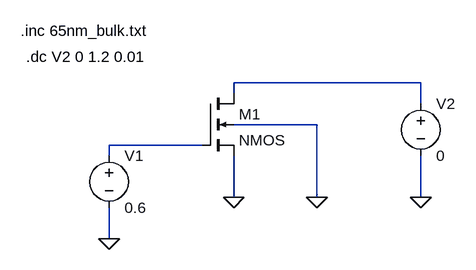
[diagram p0: schematic NMOS_Char.asc]
NMOS_Char.asc, the LTspice schematic file:
Version 4.1
SHEET 1 880 680
WIRE 464 80 176 80
WIRE 176 96 176 80
WIRE 464 112 464 80
WIRE 304 144 176 144
WIRE 128 176 -16 176
WIRE -16 192 -16 176
WIRE 176 256 176 192
WIRE 304 256 304 144
WIRE 464 256 464 192
WIRE -16 320 -16 272
FLAG -16 320 0
FLAG 176 256 0
FLAG 304 256 0
FLAG 464 256 0
SYMBOL nmos4 128 96 R0
SYMATTR InstName M1
SYMATTR Value2 l=100n w=1u
SYMBOL voltage -16 176 R0
WINDOW 123 0 0 Left 0
WINDOW 39 0 0 Left 0
SYMATTR InstName V1
SYMATTR Value 0.6
SYMBOL voltage 464 96 R0
WINDOW 123 0 0 Left 0
WINDOW 39 0 0 Left 0
SYMATTR InstName V2
SYMATTR Value 0
TEXT -152 0 Left 2 !.inc 65nm_bulk.txt
TEXT -144 40 Left 2 !.dc V2 0 1.2 0.01

The netlist it stands for:
* NMOS_Char.asc
M1 N001 N002 0 0 NMOS l=100n w=1u
V1 N002 0 0.6
V2 N001 0 0
.model NMOS NMOS
.model PMOS PMOS
.lib standard.mos
.inc 65nm_bulk.txt
.dc V2 0 1.2 0.01
.backanno
.end